# EAGLE design Battery Shield (EAGLE 6.5.0)
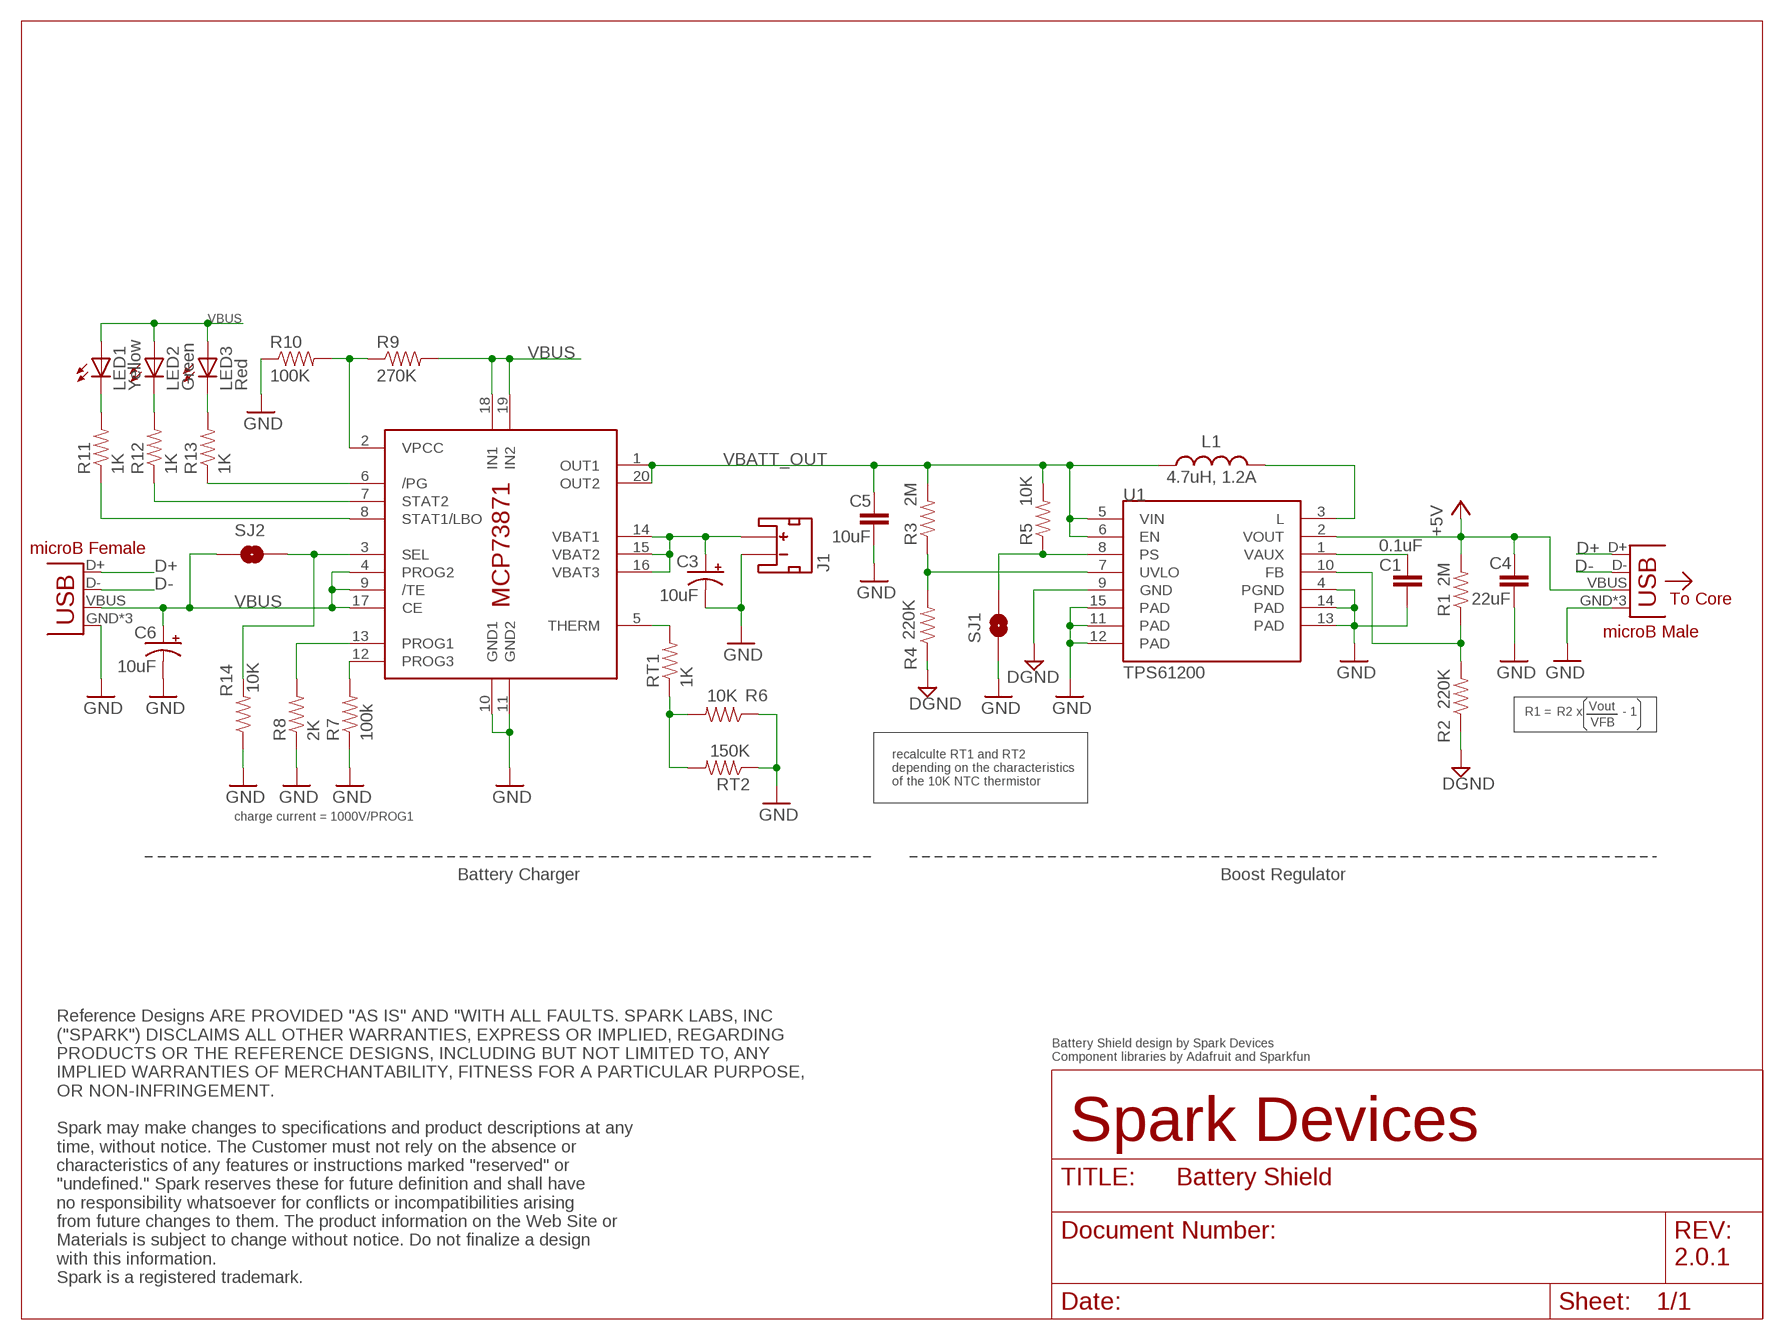
[diagram p0: schematic, sheet 1]

## Parts
C1  0.1uF  CAP0402-CAP  [0402-CAP]
C3  10uF  10UF-16V-10%(TANT)  [EIA3216]
C4  22uF  CAP0805  [0805]
C5  10uF  CAP1206  [1206]
C6  10uF  10UF-16V-10%(TANT)  [EIA3216]
IC1  MCP73871  [QFN20]
J1  JST_2MM_MALE  [JST-2-SMD]
JP1  USBUSB-MICROB-SLOT-HOLE  [USB-MICROB-SLOT-HOLE]
JP2  USBFCI  [USB-MICROB-MALE-SANDWICH]
L1  4.7uH, 1.2A  INDUCTOR.  [CDRH2D09]
LED1  Yellow  LED0603  [LED-0603]
LED2  Green  LED0603  [LED-0603]
LED3  Red  LED0603  [LED-0603]
R1  2M  RESISTOR0402-RES  [0402-RES]
R2  220K  RESISTOR0402-RES  [0402-RES]
R3  2M  RESISTOR0402-RES  [0402-RES]
R4  220K  RESISTOR0402-RES  [0402-RES]
R5  10K  RESISTOR0402-RES  [0402-RES]
R6  10K  RESISTOR0402-RES  [0402-RES]
R7  100k  RESISTOR0402-RES  [0402-RES]
R8  2K  RESISTOR0402-RES  [0402-RES]
R9  270K  RESISTOR0402-RES  [0402-RES]
R10  100K  RESISTOR0402-RES  [0402-RES]
R11  1K  RESISTOR0402-RES  [0402-RES]
R12  1K  RESISTOR0402-RES  [0402-RES]
R13  1K  RESISTOR0402-RES  [0402-RES]
R14  10K  RESISTOR0402-RES  [0402-RES]
RT1  1K  RESISTOR0402-RES  [0402-RES]
RT2  150K  RESISTOR0402-RES  [0402-RES]
SJ1  SOLDERJUMPERNO  [SJ_2S-NO]
SJ2  SOLDERJUMPERNO  [SJ_2S-NO]
U1  TPS61200  [QFN-10_PAD]

## Nets
+5V: C4.1 JP2.VBUS R1.2 U1.2(VOUT)
D+: JP1.D+ JP2.D+
D-: JP1.D- JP2.D-
DGND: R2.1 R4.1 U1.9(GND)
GND: C1.2 C3.C(-) C4.2 C5.2 C6.C(-) IC1.10(GND1) IC1.11(GND2) J1.1(-) JP1.GND JP1.MT1(GND) JP1.MT2(GND) JP2.GND JP2.GNDPAD1(GND) JP2.GNDPAD2(GND) R6.1 R7.1 R8.1 R10.1 R14.1 RT2.1 SJ1.1 U1.4(PGND) U1.11(PAD) U1.12(PAD) U1.13(PAD) U1.14(PAD) U1.15(PAD)
N$1: L1.P$2 U1.3(L)
N$2: C1.1 U1.1(VAUX)
N$3: R3.1 R4.2 U1.7(UVLO)
N$4: R1.1 R2.2 U1.10(FB)
N$5: C3.A(+) IC1.14(VBAT1) IC1.15(VBAT2) IC1.16(VBAT3) J1.2(+)
N$6: IC1.8(STAT1/LBO) R11.1
N$7: R6.2 RT1.1 RT2.2
N$8: LED1.C R11.2
N$9: IC1.5(THERM) RT1.2
N$10: LED2.C R12.2
N$11: IC1.12(PROG3) R7.2
N$12: IC1.2(VPCC) R9.1 R10.2
N$13: IC1.13(PROG1) R8.2
N$14: IC1.7(STAT2) R12.1
N$15: IC1.6(/PG) R13.1
N$16: LED3.C R13.2
N$19: R5.1 SJ1.2 U1.8(PS)
N$20: IC1.3(SEL) R14.2 SJ2.2
VBATT_OUT: C5.1 IC1.1(OUT1) IC1.20(OUT2) L1.P$1 R3.2 R5.2 U1.5(VIN) U1.6(EN)
VBUS: C6.A(+) IC1.4(PROG2) IC1.9(/TE) IC1.17(CE) IC1.18(IN1) IC1.19(IN2) JP1.VBUS LED1.A LED2.A LED3.A R9.2 SJ2.1
Unconnected: J1.NC1(PAD1) J1.NC2(PAD2)

## Notes on the sheet
- microB Female
- To Core
- microB Male
- Vout
- R1 = | R2 | x | - 1
- VFB
- recalculte RT1 and RT2
  depending on the characteristics
  of the 10K NTC thermistor
- charge current = 1000V/PROG1
- Battery Charger | Boost Regulator
- Battery Shield design by Spark Devices
  Component libraries by Adafruit and Sparkfun
- Spark Devices
- 2.0.1
- Reference Designs ARE PROVIDED "AS IS" AND "WITH ALL FAULTS. SPARK LABS, INC 
  ("SPARK") DISCLAIMS ALL OTHER WARRANTIES, EXPRESS OR IMPLIED, REGARDING 
  PRODUCTS OR THE REFERENCE DESIGNS, INCLUDING BUT NOT LIMITED TO, ANY 
  IMPLIED WARRANTIES OF MERCHANTABILITY, FITNESS FOR A PARTICULAR PURPOSE,
  OR NON-INFRINGEMENT.
  
  Spark may make changes to specifications and product descriptions at any 
  time, without notice. The Customer must not rely on the absence or 
  characteristics of any features or instructions marked "reserved" or 
  "undefined." Spark reserves these for future definition and shall have 
  no responsibility whatsoever for conflicts or incompatibilities arising 
  from future changes to them. The product information on the Web Site or 
  Materials is subject to change without notice. Do not finalize a design 
  with this information. 
  Spark is a registered trademark.

## Library data of the parts
C1 C4 = SparkFun-Passives:CAP: Capacitor Standard 0603 ceramic capacitor, and 0.1" leaded capacitor.
C3 C6 = SparkFun-Capacitors:10UF-16V-10%(TANT): CAP-00811 1206/EIA-3216 Tantalum capacitor; PROD_ID: CAP-00811
C5 = SparkFun-Capacitors:CAP: Capacitor Standard 0603 ceramic capacitor, and 0.1" leaded capacitor.
IC1 = adafruit:MCP73871
J1 = SparkFun-Connectors:JST_2MM_MALE: Mates to single-cell LiPo batteries. CONN-08352; PROD_ID: CONN-08352
JP1 JP2 = Spark:USB
L1 = SparkFun-Passives:INDUCTOR: Inductors Basic Inductor/Choke - 0603 and 1206. Footprints are not proven and vary greatly between part numbers. SRN6045- 33uH, 20% 1.4A
LED1-LED3 = SparkFun-LED:LED: LEDs Standard schematic elements and footprints for 5mm, 3mm, 1206, and 0603 sized LEDs. 5mm - Spark Fun Electronics SKU : COM-00529 (and others)
R1-R14 RT1 RT2 = SparkFun-Passives:RESISTOR: Resistor Basic schematic elements and footprints for 0603, 1206, and PTH resistors.
SJ1 SJ2 = SparkFun-Passives:SOLDERJUMPER: Solder Jumper Standard SMD solder jumper. Used to automate production. Two varients : Normally Open and Normally Closed are the same, but have different paste layers. NC will have a large amount of paste and should jumper during reflow.
U1 = SparkFun-PowerIC:TPS61200: DC to DC Booster IC-10035; PROD_ID: IC-10035

## Board
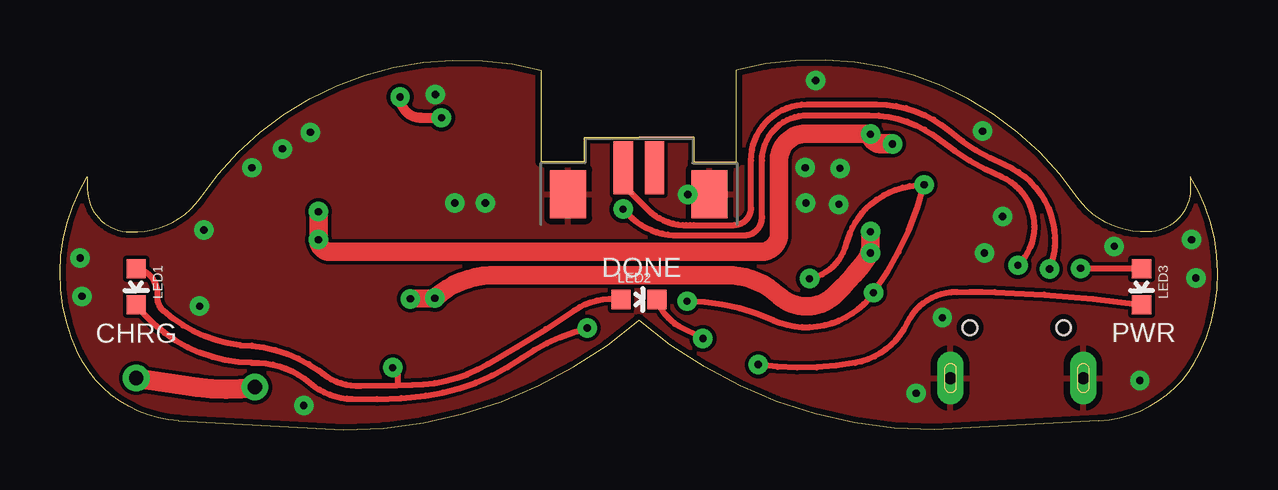
[diagram p1: board, top side]
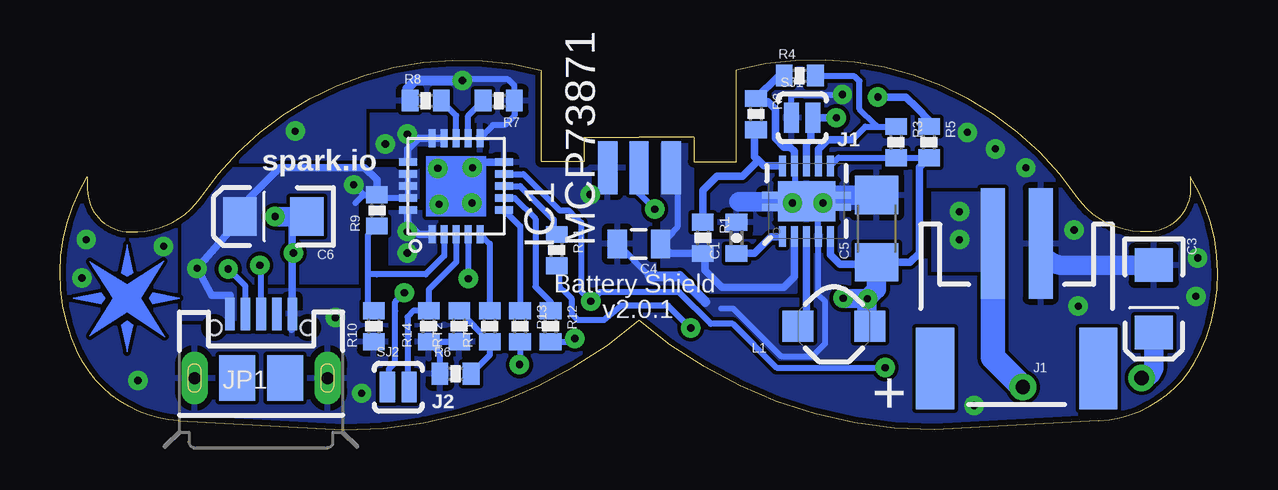
[diagram p2: board, bottom side, seen from below]

Size 48.26 x 15.41 mm. Coordinates in mm from the lower left corner, seen from the top.
Outline: 26.42,12.19 26.42,11.18 28.2,11.18 28.2,14.99 arc-70 42.42,9.65 arc57 45.34,8.25 arc90 47.12,10.03 47.12,10.54 arc-58 47.5,3.17 arc-61 43.31,0.38 36.45,0 arc-41 24.13,4.57 arc-41 11.81,0 4.95,0.38 arc-61 0.76,3.17 arc-58 1.14,10.54 1.14,10.03 arc90 2.92,8.25 arc57 5.84,9.65 arc-70 20.07,14.99 20.07,11.18 21.85,11.18 21.85,12.19 24.13,12.19 26.42,12.19
Copper layers (1*16): Top 0.035mm / dielectric 1.5mm / Bottom 0.035mm
Design rules "SparkFun *": minimum track width 8mil, minimum drill 0.3mm, track to track 6mil, track to pad 6mil, pad to pad 6mil, via to via 6mil, smd to smd 1mil, copper to edge 10mil, drill to drill 8mil, minimum pad ring 12mil, minimum via ring 10mil, stop-mask expansion 4mil, vias tented up to drill 25mil, thermal gap 10mil

### Footprints (pad centres in the part's own frame; a part is rotated, then mirrored left to right if it is on the bottom)
0402-CAP = smd 0.7 x 0.9: 1 -0.65,0; 2 0.65,0
EIA3216 = smd 1.4 x 1.6: A 1.4,0; C -1.4,0
0805 = smd 0.8 x 1.2: 1 -0.9,0; 2 0.9,0
1206 = smd 1.6 x 1.8: 1 -1.4,0; 2 1.4,0
QFN20 = smd 0.75 x 0.3: 1 -2,1; 2 -2,0.5; 3 -2,0; 4 -2,-0.5; 5 -2,-1; 11 2,-1; 12 2,-0.5; 13 2,0; 14 2,0.5; 15 2,1 | smd 0.3 x 0.75: 6 -1,-2; 7 -0.5,-2; 8 0,-2; 9 0.5,-2; 10 1,-2; 16 1,2; 17 0.5,2; 18 0,2; 19 -0.5,2; 20 -1,2
JST-2-SMD = smd 1 x 4.6: 1 -1,-3.7; 2 1,-3.7 | smd 1.6 x 3.4: NC1 -3.4,1.5; NC2 3.4,1.5
USB-MICROB-SLOT-HOLE = smd 0.4 x 1.35: D+ 0,2.675; D- -0.65,2.675; GND 1.3,2.675; ID 0.65,2.675; VBUS -1.3,2.675 | drill 0.5 pad 1.1 long: MT1 -2.775,0; MT2 2.775,0 | smd 1.5 x 1.9: P$1 -1,0; P$2 1,0.01 | hole 0.6: -1.95,2.1; 1.95,2.1
USB-MICROB-MALE-SANDWICH = smd 0.8 x 2.2 bottom: D+ 0,0; GND 1.3,0; VBUS -1.35,0 | smd 0.8 x 2.2: D- -0.65,0; ID 0.65,0 | smd 1.5 x 2: GNDPAD1 -2.95,-1.1; GNDPAD2 2.95,-1.1
CDRH2D09 = smd 1.3 x 1.3: P$1 -1.5,0; P$2 1.5,0
LED-0603 = smd 0.8 x 0.8: A 0,-0.75; C 0,0.75
0402-RES = smd 0.7 x 0.9: 1 -0.65,0; 2 0.65,0
SJ_2S-NO = smd 0.635 x 1.27: 1 -0.45,0; 2 0.45,0
QFN-10_PAD = smd 0.297 x 0.85: 1 -1,-1.475; 2 -0.5,-1.475; 3 0,-1.475; 4 0.5,-1.475; 5 1,-1.475; 6 1,1.475; 7 0.5,1.475; 8 0,1.475; 9 -0.5,1.475; 10 -1,1.475 | smd 0.7 x 0.28: 11 -1.5,0.25; 12 -1.5,-0.25; 13 1.5,0.25; 14 1.5,-0.25 | smd 2.4 x 1.65: 15 0,0

### Placement (x,y rotation side)
C1  20.07,8 90 bottom
C3  2.67,5.46 270 bottom
C4  24.13,7.75 180 bottom
C5  14.23,8.38 90 bottom
C6  39.37,8.89 180 bottom
IC1  31.75,10.16 90 bottom
J1  8.38,4.06 180 bottom
JP1  39.88,2.16 0 bottom
JP2  24.13,10.92 0 top
L1  16,4.32 180 bottom
LED1  3.18,5.97 180 top
LED2  24.13,5.44 270 top
LED3  45.09,5.97 180 top
R1  21.46,8 270 bottom
R2  19.26,13.16 270 bottom
R3  13.41,11.99 270 bottom
R4  17.43,14.76 0 bottom
R5  12.04,11.99 270 bottom
R6  31.78,2.34 0 bottom
R7  29.97,13.72 180 bottom
R8  33.02,13.72 0 bottom
R9  35.05,9.14 90 bottom
R10  35.18,4.32 90 bottom
R11  27.56,7.49 270 bottom
R12  27.81,4.32 270 bottom
R13  29.08,4.32 270 bottom
R14  32.89,4.32 90 bottom
RT1  30.35,4.32 90 bottom
RT2  31.62,4.32 90 bottom
SJ1  17.32,13 0 bottom
SJ2  34.16,1.78 0 bottom
U1  17.15,9.53 0 bottom
U$2  [SPARK_LOGO_PLUS_PLANE]  45.47,5.49 0 bottom

### Tracks (layer width: path | path; a pad name or v marks a point on that pad's centre or on a via)
+5V
  Bottom 0.254: 22.78,8.2 22.51,8.47 22.51,10.11 22.78,10.38
  Bottom 0.305: U1.2 17.65,6.38 18.09,5.94 20.68,5.94 21.39,6.65 21.39,7.28 R1.2 22.84,7.35 C4.1 22.78,8.2
  pour Bottom (no thermals): 17.58,7.87 17.58,5.74 23.17,5.74 23.17,11.99 21.9,11.99 21.9,7.87
D+  (via drill 0.3)
  Top 0.254: v23.47,9.2 23.67,8.99 arc48 25.81,8.1 28.55,8.1 arc90 29.26,8.89 29.26,11.23 arc-90 31.14,13.11 33.73,13.11 arc-39 36.7,12.06 arc15 39.24,10.54 arc-112 v39.93,6.86
  Bottom 0.254: v23.47,9.2 24.13,9.86 24.13,10.41 | JP1.D+ 39.88,6.81 v39.93,6.86
  Bottom 0.406: JP2.D+ 24.13,10.41
D-  (via drill 0.3)
  Top 0.254: 23.48,10.25 23.48,10.2 24.49,9.2 arc42 25.96,8.53 arc7 26.42,8.53 28.09,8.53 arc90 28.81,9.25 28.81,11.23 arc-90 31.14,13.56 34.04,13.56 arc-40 37.09,12.45 arc18 39.37,11.05 arc-88 v41.25,6.71
  Top 0.406: JP2.D- 23.48,10.25
  Bottom 0.254: JP1.D- 40.53,5.98 v41.25,6.71
DGND
  Bottom 0.305: U1.9 17.65,11.6 17.83,11.79 18.09,11.79 18.44,12.14 18.44,13.36 18.75,13.66 19.11,13.66 R2.1 18.3,14.76 R4.1
GND  (via drill 0.3, 0.3 pad 0.61)
  Bottom 0.254: U1.4 16.66,8.07 16.66,8.89 | U1.14 16.28,9.28 arc-90 16.66,8.89 | 16.66,8.89 16.66,9.04 arc-90 U1.15 | JP1.GND 38.58,4.2 arc90 38.61,4.17 | SJ1.1 17.77,13.97 v15.65,13.97 | C4.2 23.69,6.4 | U1.4 16.64,8.04 | U1.4 16.66,7.93 16.66,5.64 16.36,5.33 16.36,3.61 16.92,3.05 18.19,3.05 20.19,5.05 20.7,5.05 | RT2.1 R14.1 32.43,3.2 R6.1 | IC1.11 30.21,12.7 29.72,12.7 29.32,13.1 R7.1 29.32,14.34 29.59,14.61 31.45,14.61 v31.5,14.55
  Bottom 0.305: IC1.10 31.14,11.16 v32.51,10.9 | JP1.GND 38.58,7.32 | 38.58,7.32 v38.53,7.37 | 38.58,7.32 38.58,8.61 38.61,8.64
  Bottom 0.406: v31.5,14.55 33.45,14.55 33.78,14.22 33.78,13.83 R8.1 | 23.69,6.4 22.43,6.4 21.36,5.33
  Bottom 0.813: v39.3,8.89 C6.C | C5.2 16.89,9.78 U1.15 17.17,9.5 19.97,9.5 | C3.C 6.48,6.86 arc90 J1.1
  other vias: 31.07,10.92 35.69,1.52 8,10.92 43.94,7.65 47.17,7.92 0.84,7.16 45.01,2.06 0.92,5.56 47.35,6.32 6,8.33 5.82,5.16 10.44,12.4 16.46,9.45 17.73,9.45 9.27,11.71 36.78,4.67 26.16,9.8 38.46,12.45 31.09,9.45 32.46,9.4 10.16,1.02
  pour Bottom (rank 3): -6.6,-1.02 -6.6,16.76 54.36,16.76 54.36,-1.02
  pour Top (rank 3): -6.6,-1.02 -6.6,16.76 54.36,16.76 54.36,-1.02
N$1
  Bottom 0.254: 17.53,4.34 L1.P$2
  Bottom 0.305: U1.3 17.15,4.68 L1.P$2
N$2
  Bottom 0.305: U1.1 18.62,8.05 19.31,7.37 20.05,7.37 C1.1
N$3
  Bottom 0.254: R4.2 16.75,14.73 15.14,14.73 14.94,14.53 14.94,13.36 14.3,12.72 14.22,12.64 | 14.22,12.64 R3.1 | 15.24,12.09 14.69,12.64 14.22,12.64
  Bottom 0.305: 15.24,12.09 16.26,12.09 16.65,11.7 U1.7 | 16.65,14.63 R4.2
N$4
  Bottom 0.305: U1.10 18.93,11 19.15,11.23 | 19.15,11.23 19.31,11.38 19.31,12.46 R2.2 | R1.1 21.46,9.98 20.88,10.57 19.81,10.57 19.15,11.23
N$5  (via drill 0.3, 0.3 pad 0.61, 0.6)
  Top 0.762: v10.77,9.09 v10.77,7.93 arc90 11.28,7.42 29.21,7.42 arc90 29.97,8.18 29.97,11.23 arc-90 31.09,12.34 33.76,12.34 arc-90 v33.78,12.32 | 34.19,11.91 arc-90 v33.78,12.32 | v33.78,12.32 33.73,12.24
  Top 0.813: 34.19,11.91 v34.7,11.91 | v3.18,2.16 5.72,1.78 arc17 v8.13,1.78
  Bottom 0.305: IC1.14 IC1.15 33.31,12.16 | 33.31,12.16 33.78,11.68 33.78,11.19 IC1.16 | 33.31,12.16 33.62,12.16 v33.78,12.32
  Bottom 0.813: C3.A 2.67,2.67 arc90 v3.18,2.16
  Bottom 1.016: J1.2 9.38,3.03 v8.13,1.78
  pour Bottom (no thermals): 32.13,11.81 33.4,11.81 33.4,11.3 35.31,11.3 35.31,13.21 32.13,13.21
  pour Bottom (no thermals): 9.02,9.91 11.94,9.91 11.94,6.6 9.02,6.6
N$6
  Bottom 0.254: IC1.8 29.08,10.16 27.69,8.76 27.69,8.27 R11.1
N$7
  Bottom 0.254: R6.2 30.35,3.11 RT1.1 30.99,4.3 30.99,4.32 RT2.2
N$8  (via drill 0.3 pad 0.61)
  Top 0.254: v21.97,4.24 arc19 19.25,3 arc-27 15.24,1.42 arc-10 12.19,1.29 arc-41 10.42,1.96 arc43 8,2.79 arc-52 LED1.C
  Bottom 0.254: v21.97,4.24 22.91,5.18 24.87,5.18 25.6,4.57 26.67,4.57 26.93,4.83 26.93,5.46 27.18,5.71 27.43,5.97 27.43,6.72 R11.2
N$9
  Bottom 0.254: IC1.5 30.74,8.14 30.35,7.76 RT1.2
N$10  (via drill 0.3)
  Top 0.254: v26.8,3.81 25.78,4.32 arc-38 LED2.C
  Bottom 0.254: R12.2 26.81,3.67 v26.8,3.81
N$11
  Bottom 0.254: IC1.12 31.25,13.09 R7.2
N$12
  Bottom 0.254: 35.2,8.49 R9.1 35.07,8.49 35.43,8.13 35.43,6.48 | IC1.2 32.25,7.25 33.02,6.48 35.05,6.48 35.43,6.48 | 35.43,6.48 35.43,5.22 R10.2
N$13
  Bottom 0.254: IC1.13 31.75,13.1 R8.2
N$14
  Bottom 0.203: 29.74,9.65 29.31,9.65
  Bottom 0.254: 29.74,9.65 IC1.7 | 29.31,9.65 28.45,8.79 28.45,5.97 27.81,5.33 R12.1
N$15
  Bottom 0.254: IC1.6 29.08,8.49 R13.1
N$16  (via drill 0.3)
  Top 0.254: LED3.C arc6 38.97,5.74 arc4 37.39,5.74 37.36,5.74 arc64 35.31,4.45 arc-54 33.15,2.79 arc-19 v29.11,2.72
  Bottom 0.254: R13.2 29.08,2.74 v29.11,2.72
N$17  (via drill 0.3 pad 0.61)
  other vias: 14.61,5.46
N$18
  Bottom 0.254: 17.63,10.92 17.63,9.91
N$19  (via drill 0.3)
  Top 0.406: v14.17,13.87 arc90 15.04,13 v15.9,13
  Bottom 0.305: U1.8 17.15,11.91 16.97,12.09 16.97,12.91 SJ1.2 v15.9,13 | R5.1 12.04,12.9 12.55,13.41 13.01,13.87 v14.17,13.87
N$20
  Bottom 0.254: IC1.3 31.75,6.98 32.89,5.84 R14.2 33.51,4.97 33.78,4.7 33.78,1.85 SJ2.2
VBATT_OUT  (via drill 0.3 pad 0.61)
  Top 0.762: v33.78,7.37 v33.78,8.25 | 14.61,5.46 v15.62,5.49 arc-45 18.27,6.45 27.76,6.45 arc-43 29.97,5.59 arc85 32.26,5.59 arc13 v33.78,7.37 | 33.73,7.42 v33.78,7.37
  Bottom 0.254: IC1.1 33.24,8.16 33.28,8.13 | U1.6 15.81,11.34 R3.2 R5.2
  Bottom 0.305: IC1.1 33.31,8.16 33.78,8.64 33.78,9.13 IC1.20 | R5.2 12.45,10.93 12.45,7.37 12.83,6.98 C5.1 14.3,6.91 15.75,6.91 16.15,7.31 U1.5
  Bottom 0.813: v15.62,5.49 14.63,5.46 | 14.63,5.46 14.63,4.45 L1.P$1 | C5.1 14.23,5.87 14.63,5.46
  pour Bottom (no thermals): 32.51,8.64 32.51,6.86 34.55,6.86 34.55,9.14 32.51,9.14
VBUS  (via drill 0.3, 0.3 pad 0.61, 0.3 pad 0.81)
  Top 0.254: 23.23,5.59 LED2.A arc42 21.44,4.98 arc-5 17.83,2.74 arc-31 14.68,1.88 14.07,1.86 | 14.07,1.86 12.55,1.83 arc-44 10.8,2.46 arc35 7.49,3.53 arc-34 4.32,4.95 arc-54 4.07,5.59 arc87 LED1.A | v13.87,2.59 arc-90 14.07,2.39 14.07,1.86 | LED3.A 42.93,6.72 v42.55,6.73 | v26.14,5.36 arc-23 29.72,4.57 arc78 v33.91,5.71 arc21 v36.02,10.21 arc45 33.59,9.21 arc31 32.77,7.75 arc-65 v31.24,6.3
  Bottom 0.203: IC1.9
  Bottom 0.254: IC1.17 IC1.18 IC1.19 34.92,9.66 R9.2 35.6,9.79 | v13.87,2.59 18.39,2.59 20.22,4.42 21.13,4.42 22.46,5.74 25.76,5.74 v26.14,5.36 | v36.02,10.21 35.6,9.79 | IC1.4 31.25,6.54 v31.24,6.3 | 35.94,9.45 35.6,9.79 | 26.16,5.38 v26.14,5.36 | IC1.9 28.95,10.66 27.94,9.65 27.43,9.14 27.05,9.14 26.8,8.89 26.54,8.64 26.54,5.77 v26.14,5.36 | SJ2.1 34.55,1.78 34.55,2.54 34.29,2.79 34.29,4.95 34.29,5.33 v33.91,5.71
  Bottom 0.305: JP1.VBUS 41.18,5.62 41.94,5.62 v42.55,6.73 40.77,8.76 C6.A 40.39,8.89 40.39,9.65 39.12,10.92 35.56,10.92 35.05,10.41 R9.2
  pour Bottom (rank 2, no thermals): 33.28,10.92 43.18,10.92 43.18,4.57 40.9,4.57 40.9,6.1 35.82,6.1 35.82,9.65 33.28,9.65

### Text on the board
tPlace: DONE | CHRG | PWR
bPlace: J1 | spark.io | Battery Shield / v2.0.1 | J2 | +
tDocu: Reference Designs ARE PROVIDED "AS IS" AND "WITH ALL FAULTS. SPARK LABS, INC / ("SPARK") DISCLAIMS ALL OTHER WARRANTIES, EXPRESS OR IMPLIED, REGARDING / PRODUCTS OR THE REFERENCE DESIGNS, INCLUDING BUT NOT LIMITED TO, ANY / IMPLIED WARRANTIES OF MERCHANTABILITY, FITNESS FOR A PARTICULAR PURPOSE, / OR NON-INFRINGEMENT. / / Spark may make changes to specifications and product descriptions at any / time, without notice. The Customer must not rely on the absence or / characteristics of any features or instructions marked "reserved" or / "undefined." Spark reserves these for future definition and shall have / no responsibility whatsoever for conflicts or incompatibilities arising / from future changes to them. The product information on the Web Site or / Materials is subject to change without notice. Do not finalize a design / with this information. / Spark is a registered trademark.